# Altium schematic sheet NX3215SA-32.768k_Crystall_Oscillator.SchDoc: NX3215SA-32.768K Crystall Oscillator
size A4; DocumentNumber: 7; SheetNumber: 7; SheetTotal: 50
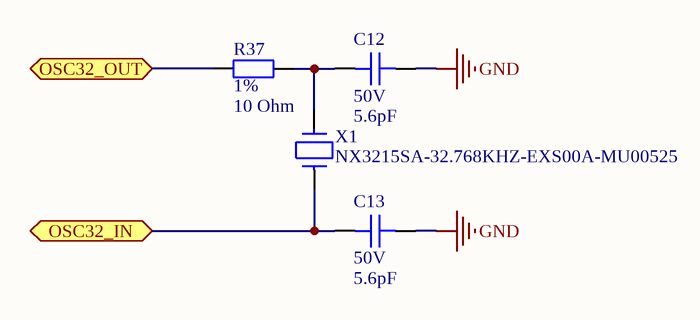
[diagram p0: NX3215SA-32.768k_Crystall_Oscillator.SchDoc]

## Parts
C12  Voltage Rating: 50V  Capacitance: 5.6pF  [C0402]  (hidden comment: CAP CER 5.6PF 50V NPO 0402)
C13  Voltage Rating: 50V  Capacitance: 5.6pF  [C0402]  (hidden comment: CAP CER 5.6PF 50V NPO 0402)
R37  Tolerance: 1%  Resistance: 10 Ohm  [R0402]  (hidden comment: RES SMD 10 OHM 1% 1/16W 0402)
X1  NX3215SA-32.768KHZ-EXS00A-MU00525  [XTAL_2SM_3R2X1R5]

## Ports
OSC32_IN, OSC32_OUT

## Nets
GND: C12.1 C13.1
OSC32_IN: C13.2 X1.1 ; port OSC32_IN
OSC32_OUT: R37.2 ; port OSC32_OUT
NetC12_2: C12.2 R37.1 X1.2

## Notes on the sheet
- Title
- Size:
- Date:
- A4
- Number:
- Time:
- Revision:
- Sheet
- of
- File:

## Library data of the parts
C12 C13 = CAP CER 5.6PF 50V NPO 0402: 5.6pF ±0.25pF 50V Ceramic Capacitor C0G, NP0 0402 (1005 Metric); Manufacturer: Yageo; Manufacturer Part Number: AC0402CRNPO9BN5R6; Supplier 1: Digi-Key; Stock 1: 39931; Pricing 1: 1=0.12, 10=0.084, 100=0.0397, 500=0.0278, 1000=0.023, 2500=0.0214, 5000=0.0196 (USD); Mount: Surface Mount; Min Operating Temperature: -55°C; Max Operating Temperature: 125°C; Packaging: Cut Tape; Ratings: AEC-Q200; ComponentLink1URL: http://www.yageo.com/documents/recent/UPY-AC_NP0X7R_16V-to-630V_11.pdf?src-supplier=Digi-Key; ComponentLink1Description: http://www.yageo.com/documents/recent/UPY-AC_NP0X7R_16V-to-630V_11.pdf?src-supplier=Digi-Key; ComponentLink2URL: http://www.yageo.com/documents/recent/UPY-AC_NP0X7R_16V-to-630V_12.pdf?src-supplier=Digi-Key; ComponentLink2Description: http://www.yageo.com/documents/recent/UPY-AC_NP0X7R_16V-to-630V_12.pdf?src-supplier=Digi-Key; Supplier Part Number 1: 311-3056-1-ND; Case/Package: 0402; ClassName: STM32G473CETx
R37 = RES SMD 10 OHM 1% 1/16W 0402: 10 Ohms ±1% 0.063W, 1/16W Chip Resistor 0402 (1005 Metric) Automotive AEC-Q200, Moisture Resistant Thick Film; Manufacturer Part Number: AC0402FR-0710RL; Manufacturer: Yageo; Power Rating: 62.5mW; Voltage Rating: 50V; Max Power Dissipation: 63mW; Temperature Coefficient: 200ppm/°C; Supplier 1: Digi-Key; Stock 1: 212882; Pricing 1: 1=0.1, 10=0.03, 100=0.012, 1000=0.0054, 2500=0.0047, 5000=0.0039 (USD); Case/Package: 0402; Case Code (Imperial): 0402; Case Code (Metric): 1005; Min Operating Temperature: -55°C; Max Operating Temperature: 155°C; Packaging: Tape and Reel; Composition: Thick Film; Number of Terminations: 2; Termination: SMD/SMT; Features: Moisture Resistant,Automotive AEC-Q200; Length: 0.039inch; Height: 0.015inch; Width: 0.02inch; Lead Free: Lead Free; ComponentLink1URL: http://www.yageo.com/documents/recent/PYu-AC_51_RoHS_L_2_revised.pdf?src-supplier=Future+Electronics; ComponentLink1Description: http://www.yageo.com/documents/recent/PYu-AC_51_RoHS_L_2_revised.pdf?src-supplier=Future+Electronics; ComponentLink2URL: http://www.yageo.com/NewPortal/yageodocoutput?fileName=/pdf/R-Chip/PYu-AC_51_RoHS_L_6.pdf&src-supplier=Digi-Key; ComponentLink2Description: http://www.yageo.com/NewPortal/yageodocoutput?fileName=/pdf/R-Chip/PYu-AC_51_RoHS_L_6.pdf&src-supplier=Digi-Key; ComponentLink3URL: http://www.mouser.com/ds/2/447/yageodocoutput-1111992.pdf?src-supplier=Mouser; ComponentLink3Description: http://www.mouser.com/ds/2/447/yageodocoutput-1111992.pdf?src-supplier=Mouser; Supplier Part Number 1: YAG3438CT-ND; ClassName: STM32G473CETx; Mount: Surface Mount
X1 = CRYSTAL 32.768KHZ 6PF SMD: 32.768kHz  Crystal 6pF 70 kOhms 2-SMD, No Lead; Manufacturer: NDK; ESR (Equivalent Series Resistance): 70kR; Supplier 1: Digi-Key; Manufacturer Part Number: NX3215SA-32.768KHZ-EXS00A-MU00525; Stock 1: 5687; Pricing 1: 1=0.68, 10=0.602, 50=0.5628, 100=0.4974, 500=0.4712, 1000=0.3927 (USD); Mount: Surface Mount; Case/Package: SMD/SMT; Min Operating Temperature: -40°C; Max Operating Temperature: 85°C; Packaging: Tape and Reel; Frequency: 32.768kHz; Load Capacitance: 6pF; Ratings: AEC-Q200; Supplier Part Number 1: 644-1386-1-ND; ClassName: STM32G473CETx